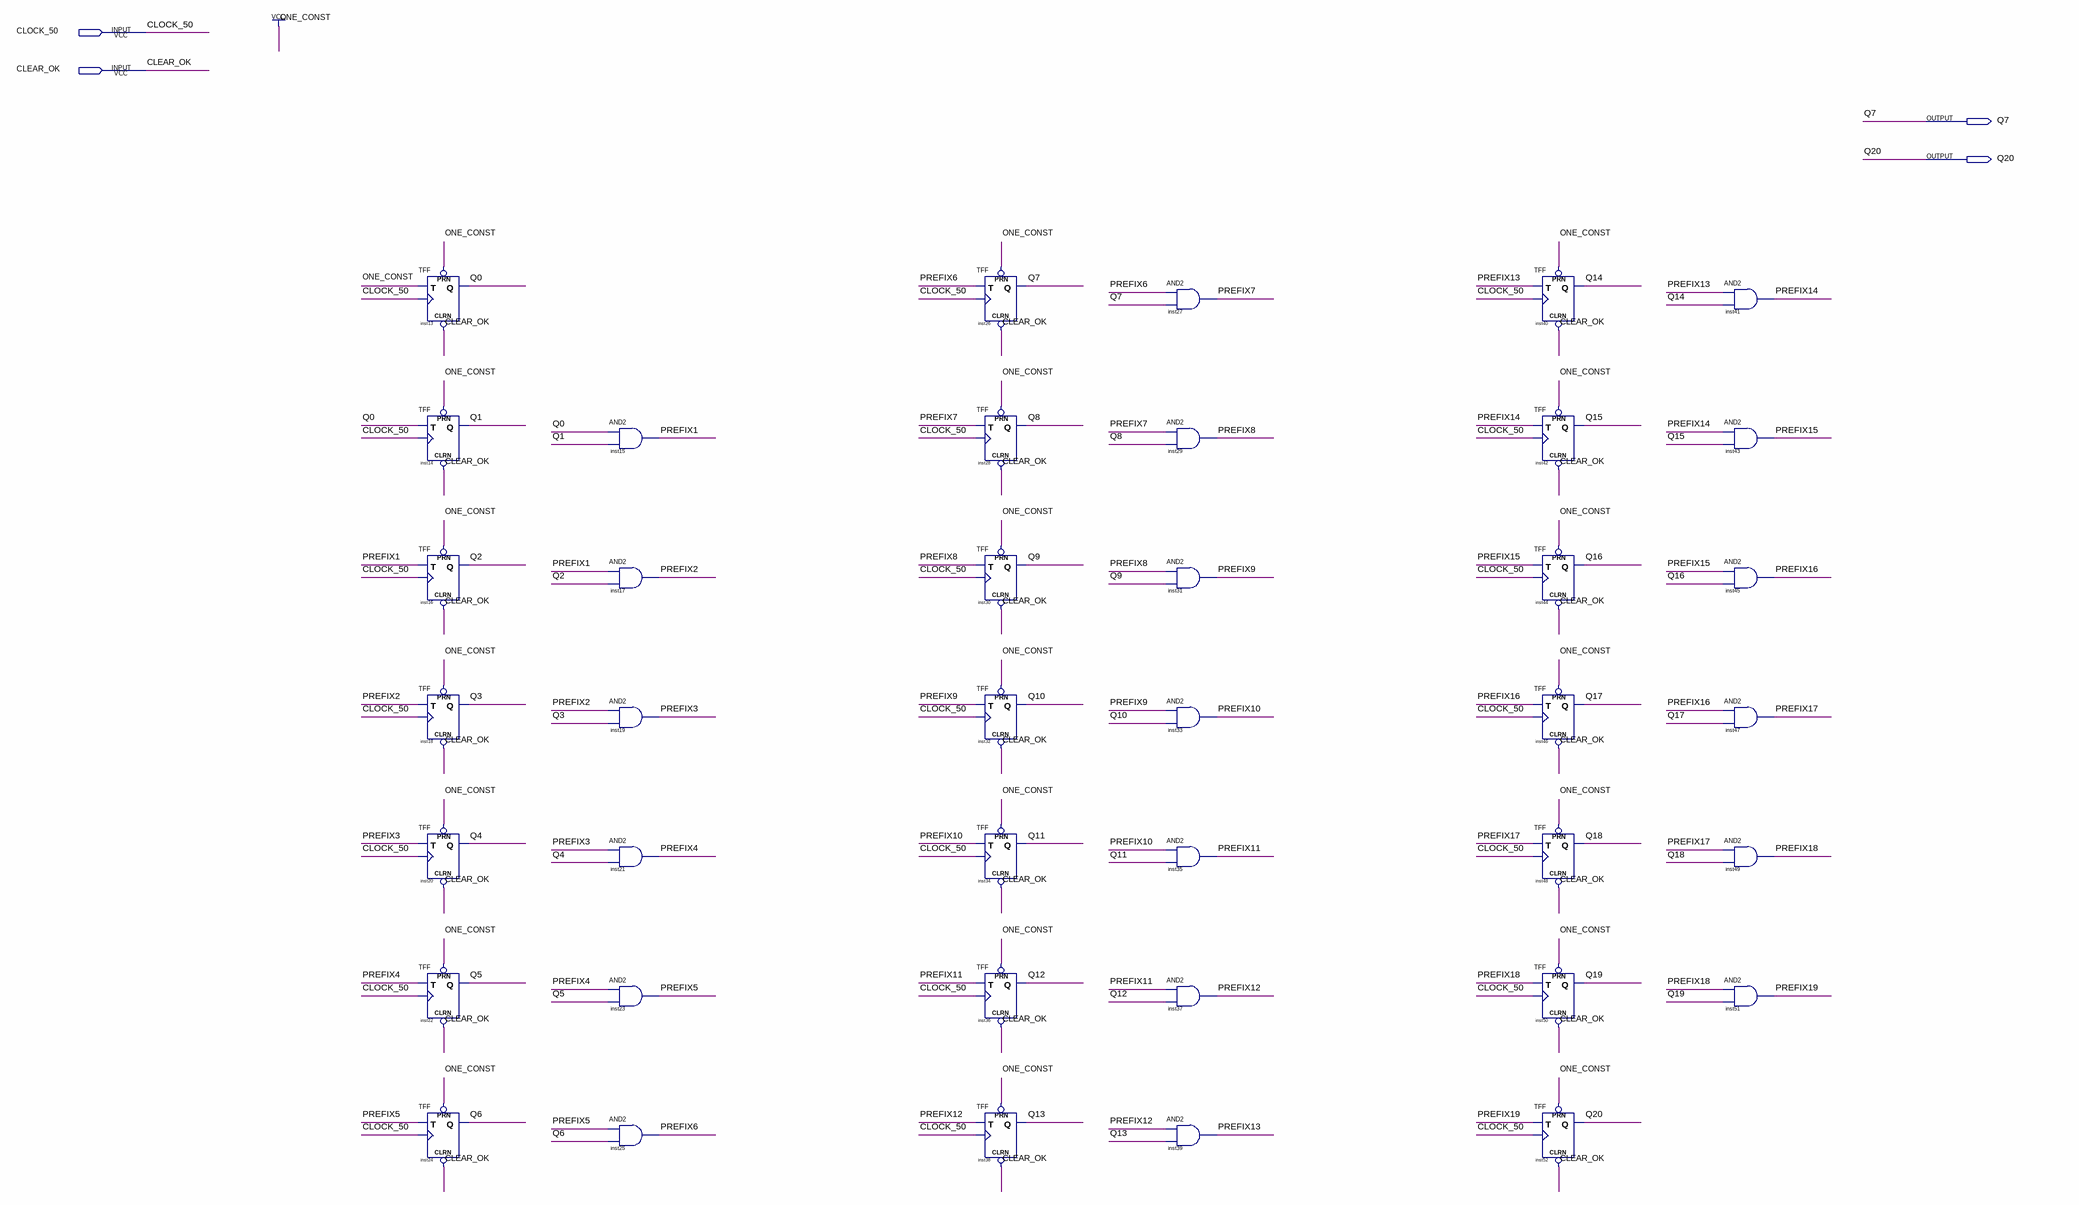
[diagram p0: schematic sheet]
// Quartus schematic CONTADOR_ANTIRREBOTE.bdf as structural Verilog: 40 symbols, 4 pins
module CONTADOR_ANTIRREBOTE (
  input  CLOCK_50,
  input  CLEAR_OK,
  output Q7,
  output Q20
);

  wire PREFIX1, PREFIX2, PREFIX3, PREFIX4, PREFIX5, PREFIX6, PREFIX7, PREFIX8, PREFIX9, PREFIX10, PREFIX11,
       PREFIX12, PREFIX13, PREFIX14, PREFIX15, PREFIX16, PREFIX17, PREFIX18, PREFIX19, Q0, Q1, Q2, Q3, Q4,
       Q5, Q6, Q8, Q9, Q10, Q11, Q12, Q13, Q14, Q15, Q16, Q17, Q18, Q19;

  TFF inst13 (.PRN(1'b1), .CLRN(CLEAR_OK), .T(1'b1), .CLK(CLOCK_50), .Q(Q0));
  TFF inst14 (.PRN(1'b1), .CLRN(CLEAR_OK), .T(Q0), .CLK(CLOCK_50), .Q(Q1));
  TFF inst16 (.PRN(1'b1), .CLRN(CLEAR_OK), .T(PREFIX1), .CLK(CLOCK_50), .Q(Q2));
  TFF inst18 (.PRN(1'b1), .CLRN(CLEAR_OK), .T(PREFIX2), .CLK(CLOCK_50), .Q(Q3));
  TFF inst20 (.PRN(1'b1), .CLRN(CLEAR_OK), .T(PREFIX3), .CLK(CLOCK_50), .Q(Q4));
  TFF inst22 (.PRN(1'b1), .CLRN(CLEAR_OK), .T(PREFIX4), .CLK(CLOCK_50), .Q(Q5));
  TFF inst24 (.PRN(1'b1), .CLRN(CLEAR_OK), .T(PREFIX5), .CLK(CLOCK_50), .Q(Q6));
  and inst15 (PREFIX1, Q0, Q1);
  and inst17 (PREFIX2, PREFIX1, Q2);
  and inst19 (PREFIX3, PREFIX2, Q3);
  and inst21 (PREFIX4, PREFIX3, Q4);
  and inst23 (PREFIX5, PREFIX4, Q5);
  and inst25 (PREFIX6, PREFIX5, Q6);
  TFF inst26 (.PRN(1'b1), .CLRN(CLEAR_OK), .T(PREFIX6), .CLK(CLOCK_50), .Q(Q7));
  TFF inst28 (.PRN(1'b1), .CLRN(CLEAR_OK), .T(PREFIX7), .CLK(CLOCK_50), .Q(Q8));
  TFF inst30 (.PRN(1'b1), .CLRN(CLEAR_OK), .T(PREFIX8), .CLK(CLOCK_50), .Q(Q9));
  TFF inst32 (.PRN(1'b1), .CLRN(CLEAR_OK), .T(PREFIX9), .CLK(CLOCK_50), .Q(Q10));
  TFF inst34 (.PRN(1'b1), .CLRN(CLEAR_OK), .T(PREFIX10), .CLK(CLOCK_50), .Q(Q11));
  TFF inst36 (.PRN(1'b1), .CLRN(CLEAR_OK), .T(PREFIX11), .CLK(CLOCK_50), .Q(Q12));
  TFF inst38 (.PRN(1'b1), .CLRN(CLEAR_OK), .T(PREFIX12), .CLK(CLOCK_50), .Q(Q13));
  and inst27 (PREFIX7, PREFIX6, Q7);
  and inst29 (PREFIX8, PREFIX7, Q8);
  and inst31 (PREFIX9, PREFIX8, Q9);
  and inst33 (PREFIX10, PREFIX9, Q10);
  and inst35 (PREFIX11, PREFIX10, Q11);
  and inst37 (PREFIX12, PREFIX11, Q12);
  and inst39 (PREFIX13, PREFIX12, Q13);
  TFF inst40 (.PRN(1'b1), .CLRN(CLEAR_OK), .T(PREFIX13), .CLK(CLOCK_50), .Q(Q14));
  TFF inst42 (.PRN(1'b1), .CLRN(CLEAR_OK), .T(PREFIX14), .CLK(CLOCK_50), .Q(Q15));
  TFF inst44 (.PRN(1'b1), .CLRN(CLEAR_OK), .T(PREFIX15), .CLK(CLOCK_50), .Q(Q16));
  TFF inst46 (.PRN(1'b1), .CLRN(CLEAR_OK), .T(PREFIX16), .CLK(CLOCK_50), .Q(Q17));
  TFF inst48 (.PRN(1'b1), .CLRN(CLEAR_OK), .T(PREFIX17), .CLK(CLOCK_50), .Q(Q18));
  TFF inst50 (.PRN(1'b1), .CLRN(CLEAR_OK), .T(PREFIX18), .CLK(CLOCK_50), .Q(Q19));
  TFF inst52 (.PRN(1'b1), .CLRN(CLEAR_OK), .T(PREFIX19), .CLK(CLOCK_50), .Q(Q20));
  and inst41 (PREFIX14, PREFIX13, Q14);
  and inst43 (PREFIX15, PREFIX14, Q15);
  and inst45 (PREFIX16, PREFIX15, Q16);
  and inst47 (PREFIX17, PREFIX16, Q17);
  and inst49 (PREFIX18, PREFIX17, Q18);
  and inst51 (PREFIX19, PREFIX18, Q19);
endmodule
